# EasyEDA Pro project 32位四合一电调核心板.epro, schematic 100V_四路_控制板
Board Name: 100V_四路_控制板; Create Date: 2025-03-10; Page Name: P1; Project Name: 32位四合一电调核心板; Schematic Name: 100V_四路_控制板; Update Date: 2025-03-10; Company: urmouky; Drawed: urmouky; Page Size: A4; Reviewed: urmouky; Version: V1.0
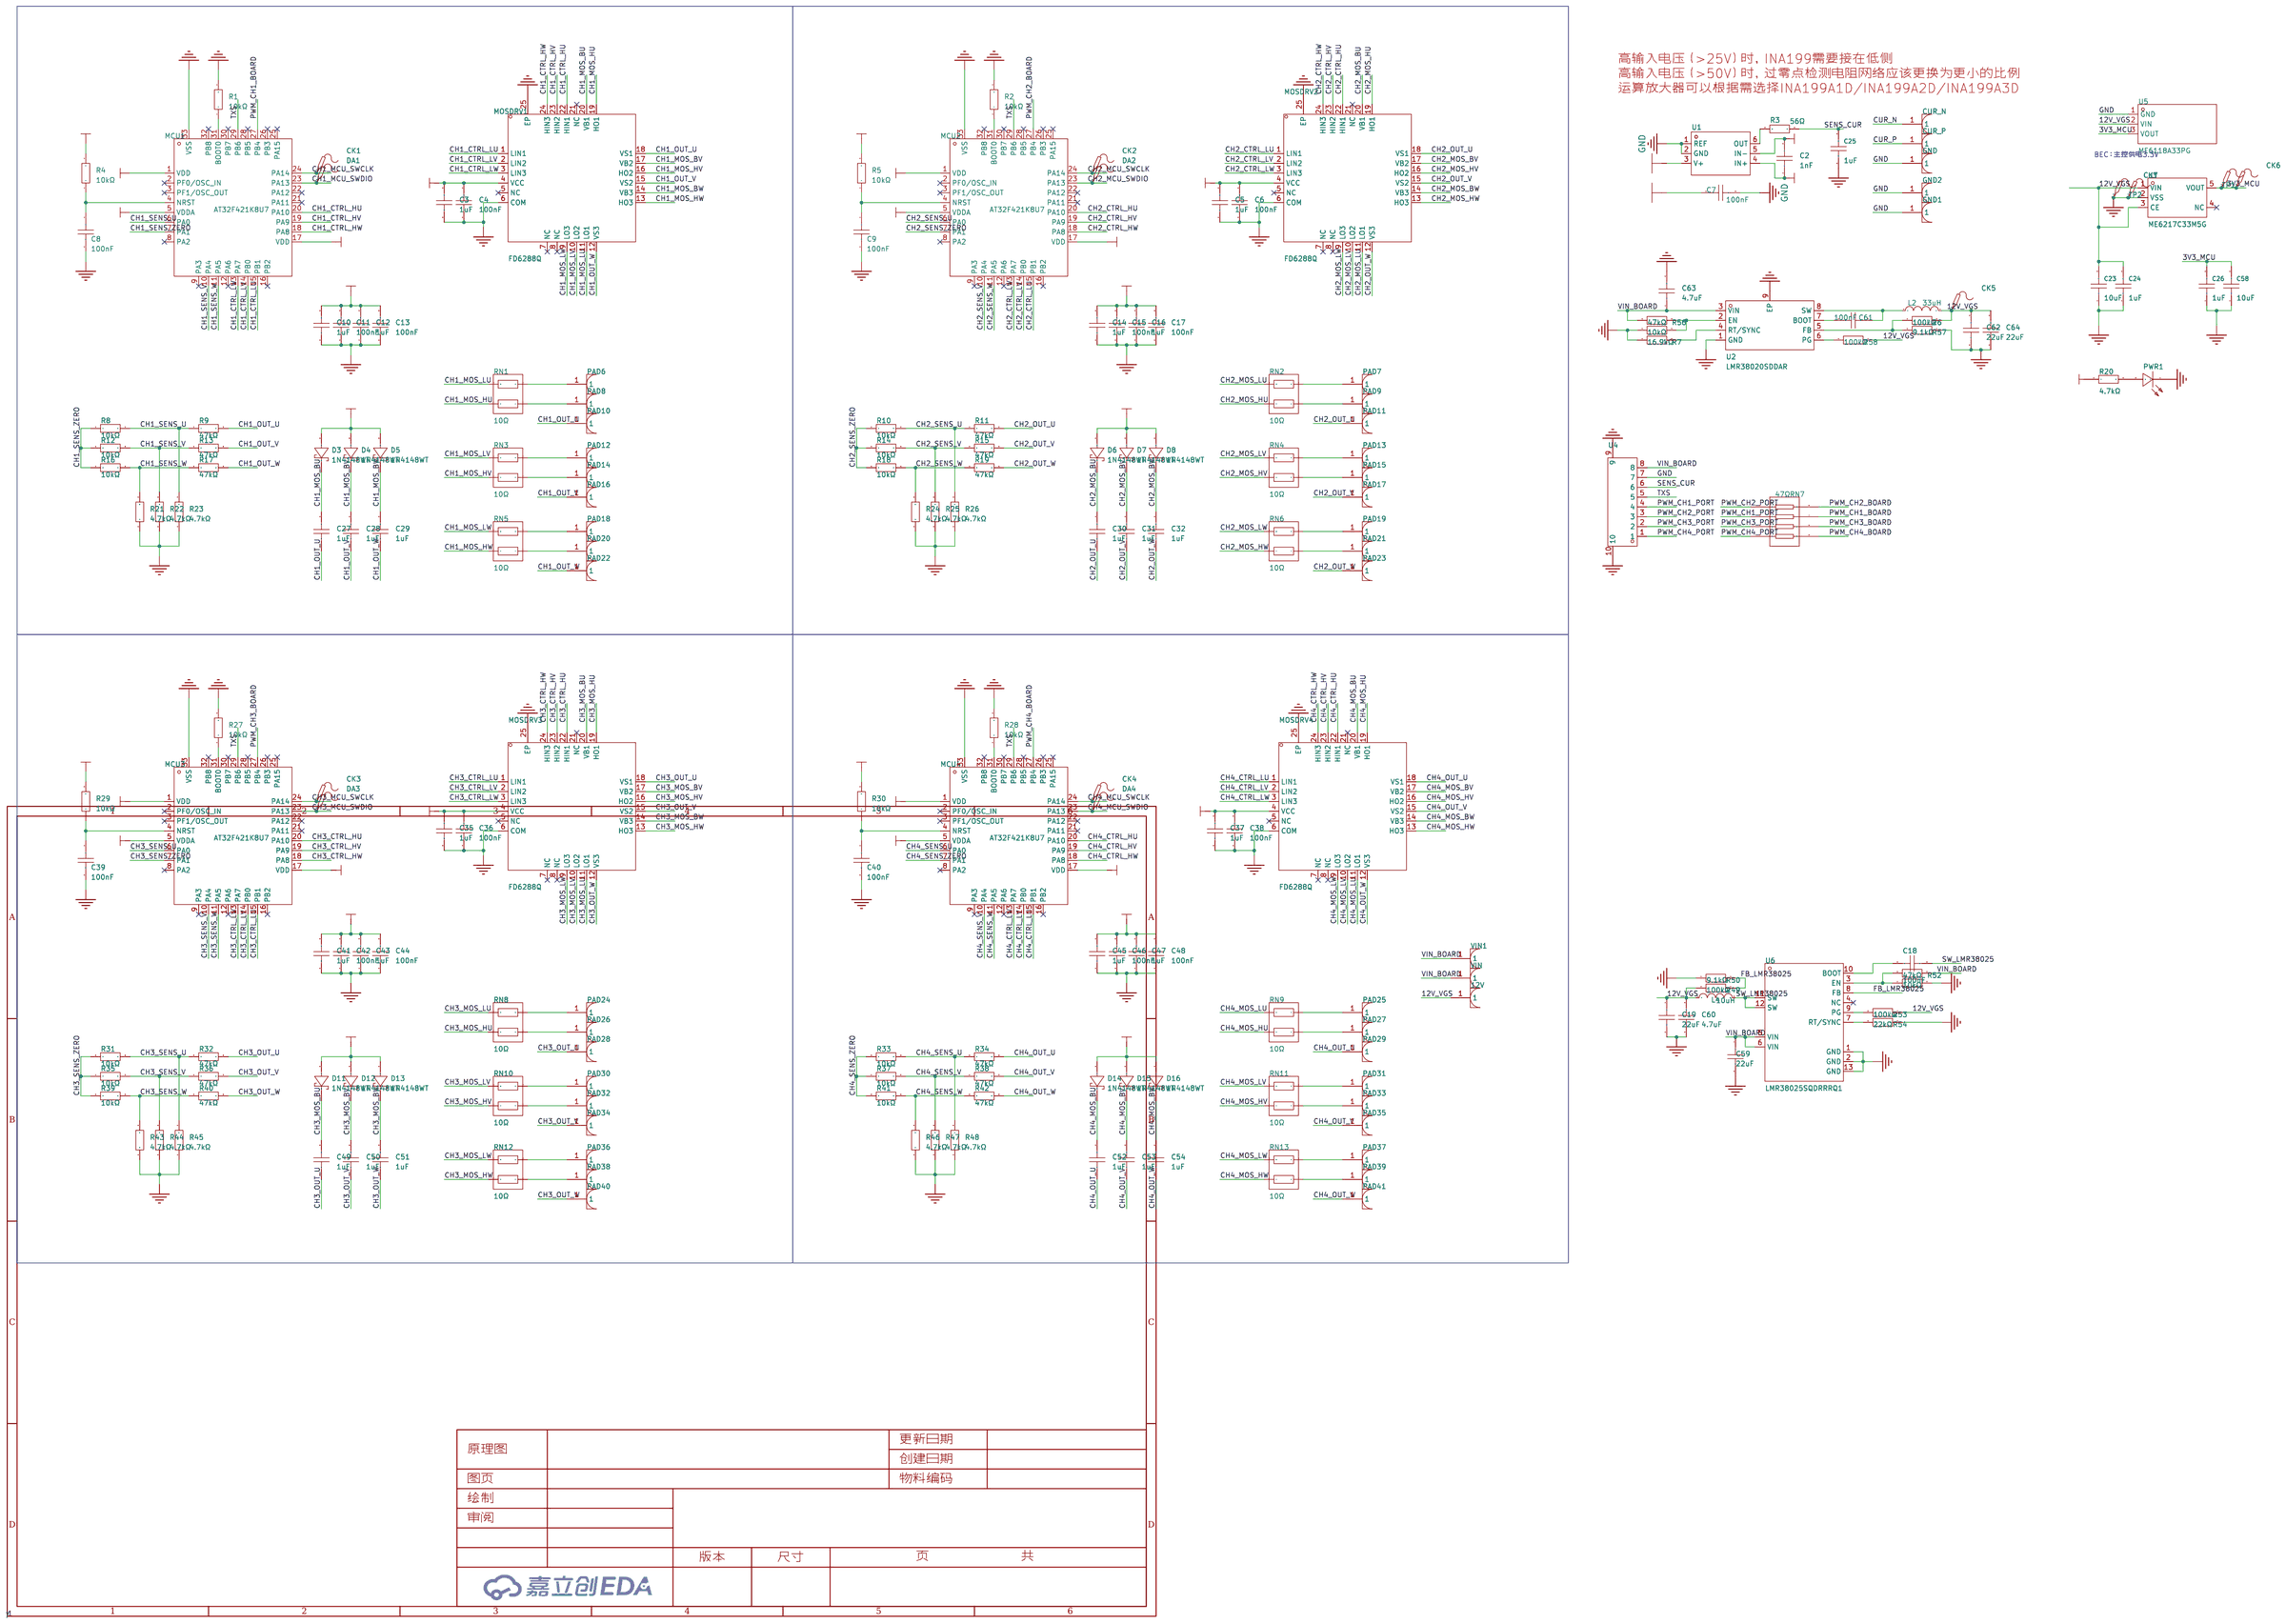
[diagram p0: schematic sheet]

## Parts
12V  -  [邮票孔1mm方]  (no BOM)
C2  1nF  [R0402]
C3  1uF  [R0402]  (no BOM)
C4  100nF  [R0402]
C5  1uF  [R0402]  (no BOM)
C6  100nF  [R0402]
C7  100nF  [R0402]
C8  100nF  [R0402]
C9  100nF  [R0402]
C10  1uF  [R0402]
C11  100nF  [R0402]
C12  1uF  [R0402]  (no BOM)
C13  100nF  [R0402]  (no BOM)
C14  1uF  [R0402]
C15  100nF  [R0402]
C16  1uF  [R0402]  (no BOM)
C17  100nF  [R0402]  (no BOM)
C18  100nF  [R0402]  (no BOM)
C19  22uF  [C1206]  (no BOM)
C23  10uF  [R0603]
C24  1uF  [R0402]
C25  1uF  [R0402]
C26  1uF  [R0402]
C27  1uF  [R0402]
C28  1uF  [R0402]
C29  1uF  [R0402]
C30  1uF  [R0402]
C31  1uF  [R0402]
C32  1uF  [R0402]
C35  1uF  [R0402]  (no BOM)
C36  100nF  [R0402]
C37  1uF  [R0402]  (no BOM)
C38  100nF  [R0402]
C39  100nF  [R0402]
C40  100nF  [R0402]
C41  1uF  [R0402]
C42  100nF  [R0402]
C43  1uF  [R0402]  (no BOM)
C44  100nF  [R0402]  (no BOM)
C45  1uF  [R0402]
C46  100nF  [R0402]
C47  1uF  [R0402]  (no BOM)
C48  100nF  [R0402]  (no BOM)
C49  1uF  [R0402]
C50  1uF  [R0402]
C51  1uF  [R0402]
C52  1uF  [R0402]
C53  1uF  [R0402]
C54  1uF  [R0402]
C58  10uF  [R0603]
C59  22uF  [C1206]  (no BOM)
C60  4.7uF  [C0805]  (no BOM)
C61  100nF  [R0402]
C62  22uF  [C1206]
C63  4.7uF  [C1206]
C64  22uF  [CAP-SMD_L3.5-W2.8-R-RD]
CK1  -  [Test-Point-0.5mm]  (no BOM)
CK2  -  [Test-Point-0.5mm]  (no BOM)
CK3  -  [Test-Point-0.5mm]  (no BOM)
CK4  -  [Test-Point-0.5mm]  (no BOM)
CK5  -  [Test-Point-0.5mm]  (no BOM)
CK6  -  [Test-Point-0.5mm]  (no BOM)
CK7  -  [Test-Point-0.5mm]  (no BOM)
CUR_N  -  [邮票孔1mm方]  (no BOM)
CUR_P  -  [邮票孔1mm方]  (no BOM)
D3  1N4148WT  [SOD-523_L1.2-W0.8-LS1.6-RD]
D4  1N4148WT  [SOD-523_L1.2-W0.8-LS1.6-RD]
D5  1N4148WT  [SOD-523_L1.2-W0.8-LS1.6-RD]
D6  1N4148WT  [SOD-523_L1.2-W0.8-LS1.6-RD]
D7  1N4148WT  [SOD-523_L1.2-W0.8-LS1.6-RD]
D8  1N4148WT  [SOD-523_L1.2-W0.8-LS1.6-RD]
D11  1N4148WT  [SOD-523_L1.2-W0.8-LS1.6-RD]
D12  1N4148WT  [SOD-523_L1.2-W0.8-LS1.6-RD]
D13  1N4148WT  [SOD-523_L1.2-W0.8-LS1.6-RD]
D14  1N4148WT  [SOD-523_L1.2-W0.8-LS1.6-RD]
D15  1N4148WT  [SOD-523_L1.2-W0.8-LS1.6-RD]
D16  1N4148WT  [SOD-523_L1.2-W0.8-LS1.6-RD]
DA1  -  [Test-Point-0.5mm]  (no BOM)
DA2  -  [Test-Point-0.5mm]  (no BOM)
DA3  -  [Test-Point-0.5mm]  (no BOM)
DA4  -  [Test-Point-0.5mm]  (no BOM)
GND  -  [邮票孔1mm方]  (no BOM)
GND1  -  [邮票孔1mm方]  (no BOM)
GND2  -  [邮票孔1mm方]  (no BOM)
L2  33uH  [IND-SMD_L5.4-W5.2]
L4  10uH  [IND-SMD_L5.4-W5.2]  (no BOM)
MCU1  AT32F421K8U7  [QFN-32_L5.0-W5.0-P0.50-BL-EP3.4]
MCU2  AT32F421K8U7  [QFN-32_L5.0-W5.0-P0.50-BL-EP3.4]
MCU3  AT32F421K8U7  [QFN-32_L5.0-W5.0-P0.50-BL-EP3.4]
MCU4  AT32F421K8U7  [QFN-32_L5.0-W5.0-P0.50-BL-EP3.4]
MOSDRV1  FD6288Q  [QFN-24_L4.0-W4.0-P0.50-BL-EP2.6]
MOSDRV2  FD6288Q  [QFN-24_L4.0-W4.0-P0.50-BL-EP2.6]
MOSDRV3  FD6288Q  [QFN-24_L4.0-W4.0-P0.50-BL-EP2.6]
MOSDRV4  FD6288Q  [QFN-24_L4.0-W4.0-P0.50-BL-EP2.6]
PAD6  -  [邮票孔1mm方]  (no BOM)
PAD7  -  [邮票孔1mm方]  (no BOM)
PAD8  -  [邮票孔1mm方]  (no BOM)
PAD9  -  [邮票孔1mm方]  (no BOM)
PAD10  -  [邮票孔1mm方]  (no BOM)
PAD11  -  [邮票孔1mm方]  (no BOM)
PAD12  -  [邮票孔1mm方]  (no BOM)
PAD13  -  [邮票孔1mm方]  (no BOM)
PAD14  -  [邮票孔1mm方]  (no BOM)
PAD15  -  [邮票孔1mm方]  (no BOM)
PAD16  -  [邮票孔1mm方]  (no BOM)
PAD17  -  [邮票孔1mm方]  (no BOM)
PAD18  -  [邮票孔1mm方]  (no BOM)
PAD19  -  [邮票孔1mm方]  (no BOM)
PAD20  -  [邮票孔1mm方]  (no BOM)
PAD21  -  [邮票孔1mm方]  (no BOM)
PAD22  -  [邮票孔1mm方]  (no BOM)
PAD23  -  [邮票孔1mm方]  (no BOM)
PAD24  -  [邮票孔1mm方]  (no BOM)
PAD25  -  [邮票孔1mm方]  (no BOM)
PAD26  -  [邮票孔1mm方]  (no BOM)
PAD27  -  [邮票孔1mm方]  (no BOM)
PAD28  -  [邮票孔1mm方]  (no BOM)
PAD29  -  [邮票孔1mm方]  (no BOM)
PAD30  -  [邮票孔1mm方]  (no BOM)
PAD31  -  [邮票孔1mm方]  (no BOM)
PAD32  -  [邮票孔1mm方]  (no BOM)
PAD33  -  [邮票孔1mm方]  (no BOM)
PAD34  -  [邮票孔1mm方]  (no BOM)
PAD35  -  [邮票孔1mm方]  (no BOM)
PAD36  -  [邮票孔1mm方]  (no BOM)
PAD37  -  [邮票孔1mm方]  (no BOM)
PAD38  -  [邮票孔1mm方]  (no BOM)
PAD39  -  [邮票孔1mm方]  (no BOM)
PAD40  -  [邮票孔1mm方]  (no BOM)
PAD41  -  [邮票孔1mm方]  (no BOM)
PWR1  NCD0603G1  [LED0603-RD_1]
R1  10kΩ  [R0402]
R2  10kΩ  [R0402]
R3  56Ω  [R0402]
R4  10kΩ  [R0402]
R5  10kΩ  [R0402]
R6  100kΩ  [R0402]
R7  16.9kΩ  [R0402]
R8  10kΩ  [R0402]
R9  47kΩ  [R0402]
R10  10kΩ  [R0402]
R11  47kΩ  [R0402]
R12  10kΩ  [R0402]
R13  47kΩ  [R0402]
R14  10kΩ  [R0402]
R15  47kΩ  [R0402]
R16  10kΩ  [R0402]
R17  47kΩ  [R0402]
R18  10kΩ  [R0402]
R19  47kΩ  [R0402]
R20  4.7kΩ  [R0402]
R21  4.7kΩ  [R0402]
R22  4.7kΩ  [R0402]
R23  4.7kΩ  [R0402]
R24  4.7kΩ  [R0402]
R25  4.7kΩ  [R0402]
R26  4.7kΩ  [R0402]
R27  10kΩ  [R0402]
R28  10kΩ  [R0402]
R29  10kΩ  [R0402]
R30  10kΩ  [R0402]
R31  10kΩ  [R0402]
R32  47kΩ  [R0402]
R33  10kΩ  [R0402]
R34  47kΩ  [R0402]
R35  10kΩ  [R0402]
R36  47kΩ  [R0402]
R37  10kΩ  [R0402]
R38  47kΩ  [R0402]
R39  10kΩ  [R0402]
R40  47kΩ  [R0402]
R41  10kΩ  [R0402]
R42  47kΩ  [R0402]
R43  4.7kΩ  [R0402]
R44  4.7kΩ  [R0402]
R45  4.7kΩ  [R0402]
R46  4.7kΩ  [R0402]
R47  4.7kΩ  [R0402]
R48  4.7kΩ  [R0402]
R49  100kΩ  [R0402]  (no BOM)
R50  9.1kΩ  [R0402]  (no BOM)
R51  10kΩ  [R0402]  (no BOM)
R52  47kΩ  [R0402]  (no BOM)
R53  100kΩ  [R0402]  (no BOM)
R54  22kΩ  [R0402]  (no BOM)
R55  10kΩ  [R0402]
R56  47kΩ  [R0402]
R57  9.1kΩ  [R0402]
R58  100kΩ  [R0402]
RN1  10Ω  [RES-ARRAY-SMD_0402-4P-L1.0-W1.0-BL]
RN2  10Ω  [RES-ARRAY-SMD_0402-4P-L1.0-W1.0-BL]
RN3  10Ω  [RES-ARRAY-SMD_0402-4P-L1.0-W1.0-BL]
RN4  10Ω  [RES-ARRAY-SMD_0402-4P-L1.0-W1.0-BL]
RN5  10Ω  [RES-ARRAY-SMD_0402-4P-L1.0-W1.0-BL]
RN6  10Ω  [RES-ARRAY-SMD_0402-4P-L1.0-W1.0-BL]
RN7  47Ω  [RES-ARRAY-SMD_0402-8P-L2.0-W1.0-BL]
RN8  10Ω  [RES-ARRAY-SMD_0402-4P-L1.0-W1.0-BL]
RN9  10Ω  [RES-ARRAY-SMD_0402-4P-L1.0-W1.0-BL]
RN10  10Ω  [RES-ARRAY-SMD_0402-4P-L1.0-W1.0-BL]
RN11  10Ω  [RES-ARRAY-SMD_0402-4P-L1.0-W1.0-BL]
RN12  10Ω  [RES-ARRAY-SMD_0402-4P-L1.0-W1.0-BL]
RN13  10Ω  [RES-ARRAY-SMD_0402-4P-L1.0-W1.0-BL]
TP1  -  [Test-Point-0.5mm]  (no BOM)
TP2  -  [Test-Point-0.5mm]  (no BOM)
U1  INA199A1DCKR  [SC-70-6_L2.2-W1.3-P0.65-LS2.1-BR]
U2  LMR38020SDDAR  [ESOP-8_L4.9-W3.9-P1.27-LS6.0-BL-EP-1]
U3  ME6217C33M5G  [SOT-23-5_L3.0-W1.7-P0.95-LS2.8-BR]  (no BOM)
U4  HDGC1002WR-S-8P  [CONN-SMD_8P-P1.00_HDGC_HDGC1002WR-S-8P]
U5  ME6118A33PG  [SOT-89-3_L4.5-W2.5-P1.50-LS4.2-BR]
U6  LMR38025SQDRRRQ1  [SON-12_L3.0-W3.0-P0.50-BL-EP]  (no BOM)
VIN  -  [邮票孔1mm方]  (no BOM)
VIN1  -  [邮票孔1mm方]  (no BOM)

## Library data of the parts
12V CUR_N CUR_P GND GND1 GND2 PAD6-PAD41 VIN VIN1 = 邮票孔1mm方: 1mm方形邮票孔
C2 = CC0402KRX7R9BB102: 容值:1nF;精度:±10%;额定电压:50V;材质(温度系数):X7R;; LCSC Part Name: 1nF ±10% 50V; Supplier Part: C106205; Manufacturer: YAGEO(国巨); Supplier Footprint: 0402; JLCPCB Part Class: Extended Part; Datasheet: https://atta.szlcsc.com/upload/public/pdf/source/20181008/C309510_22F155564471FAF6A489F7D68F34234E.pdf; Supplier: LCSC; Tolerance: ±10%; Voltage Rated: 50V; Temperature Coefficient: X7R
C3 C5 C10 C12 C14 C16 C24-C32 C35 C37 C41 C43 C45 C47 C49-C54 = CGA0402X5R105K500GT: 容值:1uF;精度:±10%;额定电压:50V;材质(温度系数):X5R;; LCSC Part Name: 1uF ±10% 50V; Supplier Part: C6119811; Manufacturer: HRE(芯声); Supplier Footprint: 0402; JLCPCB Part Class: Extended Part; Supplier: LCSC; Tolerance: ±10%; Voltage Rated: 50V; Temperature Coefficient: X5R
C4 C6 C8 C9 C11 C13 C15 C17 C18 C36 C38-C40 C42 C44 C46 C48 C61 = GRM155R71H104KE14D: 容值:100nF;精度:±10%;额定电压:50V;材质(温度系数):X7R;; LCSC Part Name: 100nF ±10% 50V; Supplier Part: C77020; Manufacturer: muRata(村田); Supplier Footprint: 0402; JLCPCB Part Class: Extended Part; Datasheet: https://atta.szlcsc.com/upload/public/pdf/source/20180326/C77020_39BD49C951FF1AF0DB1F1FAC5AC1E401.pdf; Supplier: LCSC; Tolerance: ±10%; Voltage Rated: 50V; Temperature Coefficient: X7R
C7 = CAP_0402: 容值:100nF;精度:±10%;额定电压:16V;温度系数:X7R;; Supplier Part: C1525; Supplier Footprint: 0402
C19 C59 C62 = CL31A226KAHNNNE: 容值:22uF;精度:±10%;额定电压:25V;材质(温度系数):X5R;; LCSC Part Name: 22uF ±10% 25V; Supplier Part: C12891; Manufacturer: SAMSUNG(三星); Supplier Footprint: 1206; JLCPCB Part Class: Basic Part; Datasheet: https://atta.szlcsc.com/upload/public/pdf/source/20160218/1457707763339.pdf; Supplier: LCSC; Tolerance: ±10%; Voltage Rated: 25V; Temperature Coefficient: X5R
C23 C58 = GRM188R61E106KA73D: 容值:10uF;精度:±10%;额定电压:25V;材质(温度系数):X5R;; LCSC Part Name: 10uF ±10% 25V; Supplier Part: C344022; Manufacturer: muRata(村田); Supplier Footprint: 0603; JLCPCB Part Class: Extended Part; Datasheet: https://atta.szlcsc.com/upload/public/pdf/source/20181211/C344022_BB98D43E7DA95E5A749FBFE073C8A3E0.pdf; Supplier: LCSC; Tolerance: ±10%; Voltage Rated: 25V; Temperature Coefficient: X5R
C60 = C2012X5R2A475K125AC: 容值:4.7uF;精度:±10%;额定电压:100V;材质(温度系数):X5R;; LCSC Part Name: 4.7uF ±10% 100V; Supplier Part: C3848621; Manufacturer: TDK; Supplier Footprint: 0805; JLCPCB Part Class: 扩展库; Datasheet: https://atta.szlcsc.com/upload/public/pdf/source/231023/files-179e77ec57705f1f6a0fa868e4e425d4.pdf; Supplier: LCSC; Tolerance: ±10%; Voltage Rated: 100V; Temperature Coefficient: X5R
C63 = GRM31CC72A475KE11L: 容值:4.7uF;精度:±10%;额定电压:100V;材质(温度系数):X7S;; LCSC Part Name: 4.7uF ±10% 100V; Supplier Part: C237304; Manufacturer: muRata(村田); Supplier Footprint: 1206; JLCPCB Part Class: Extended Part; Datasheet: https://atta.szlcsc.com/upload/public/pdf/source/20200508/C237304_4DE028CC8A94E401326C46A1633456FC.pdf; Supplier: LCSC; Tolerance: ±10%; Voltage Rated: 100V; Temperature Coefficient: X7S
C64 = TAJB226K020RNJ: 容值:22uF;精度:±10%;额定电压:20V;等效串联电阻:1.8Ω@100kHz;; LCSC Part Name: 22uF ±10% 20V; Supplier Part: C7199; Manufacturer: Kyocera AVX; Supplier Footprint: CASE-B-3528; JLCPCB Part Class: Extended Part; Datasheet: https://atta.szlcsc.com/upload/public/pdf/source/20160107/1457707750344.pdf; Supplier: LCSC; Tolerance: ±10%; Rated Voltage: 20V; Equivalent Series Resistance(ESR): 1.8Ω@100kHz; Operating Temperature: -55℃~+125℃
CK1-CK7 DA1-DA4 TP1 TP2 = Test-Point: Test Point 测试点
D3-D8 D11-D16 = 1N4148WT_C727112: 二极管配置:独立式;正向压降(Vf):1.25V@150mA;直流反向耐压(Vr):75V;平均整流电流(Io):125mA;反向恢复时间(trr):4ns;; LCSC Part Name: 电压:75V 电流:125mA; Supplier Part: C727112; Manufacturer: TWGMC(台湾迪嘉); Supplier Footprint: SOD-523; JLCPCB Part Class: 扩展库; Datasheet: https://atta.szlcsc.com/upload/public/pdf/source/20200828/C727112_FCA71CBB186A515518FBD85DA79D41CF.pdf; Supplier: LCSC; Diode Configuration: 独立式; Forward Voltage (Vf@If): 1.25V@150mA; Reverse Voltage (Vr): 75V; Average Rectified Current (Io): 125mA; Reverse Leakage Current: 1uA@75V; Reverse Recovery Time (trr): 4ns; Operating Temperature: -65℃~+150℃@(Tj)
L2 L4 = ZEMS0530-330M: 电感值:33uH;精度:±20%;额定电流:1.2A;饱和电流(Isat):2A;类型:一体成型电感;; Supplier Part: C41413117; Manufacturer: ZE(增益); Supplier Footprint: SMD,5.4x5.2mm; Datasheet: https://atta.szlcsc.com/upload/public/pdf/source/20240923/DDA01E9BD2756F7277569EBE56A30EF4.pdf; Supplier: LCSC; Tolerance: ±20%; Rated Current: 1.2A; Saturation Current (Isat): 2A; DC Resistance (DCR): 395mΩ; Type: 一体成型电感
MCU1-MCU4 = AT32F421K8U7: Supplier Part: C2965611; Manufacturer: ARTERY(雅特力); Supplier Footprint: QFN-32; JLCPCB Part Class: 扩展库; Supplier: LCSC
MOSDRV1-MOSDRV4 = FD6288Q: Supplier Part: C328453; Manufacturer: Fortior Tech(峰岹); Supplier Footprint: QFN-24-EP(4x4); JLCPCB Part Class: 扩展库; Datasheet: https://atta.szlcsc.com/upload/public/pdf/source/20181108/C328453_785547738DB9FC0123219FC22539EFAD.pdf; Supplier: LCSC
PWR1 = NCD0603G1: 发光颜色:翠绿色;正向电压(VF):2.6V~3.6V;功率:72mW;正向电流:10mA;主波长:515nm~530nm;透镜颜色:无色透明透镜;发光强度:330mcd~900mcd;发光角度:130°;工作温度:-30℃~+85℃;; Supplier Part: C84267; Manufacturer: 国星光电; Supplier Footprint: 0603; JLCPCB Part Class: Extended Part; Datasheet: https://atta.szlcsc.com/upload/public/pdf/source/20200820/C84267_04BA7703640BAC111D09F5EFB971FBF3.pdf; Supplier: LCSC; Emitted Color: 翠绿色; Forward Voltage (VF): 2.6V~3.6V; Power Dissipation: 72mW; Forward Current: 10mA; Dominant Wavelength: 515nm~530nm; Lens Color: 无色透明透镜; Luminous Intensity: 330mcd~900mcd; Viewing Angle: 130°; Operating Temperature: -30℃~+85℃
R1 R2 R4 R5 R8 R10 R12 R14 R16 R18 R27-R31 R33 R35 R37 R39 R41 R51 R55 = RC0402FR-0710KL: 电阻类型:厚膜电阻;阻值:10kΩ;精度:±1%;功率:62.5mW;最大工作电压:50V;温度系数:±100ppm/℃;; LCSC Part Name: 厚膜电阻 10kΩ ±1% 62.5mW; Supplier Part: C60490; Manufacturer: YAGEO(国巨); Supplier Footprint: 0402; JLCPCB Part Class: Extended Part; Datasheet: https://atta.szlcsc.com/upload/public/pdf/source/20170925/C131467_1506321478108990263.pdf; Supplier: LCSC; Type: 厚膜电阻; Tolerance: ±1%; Power(Watts): 62.5mW; Overload Voltage (Max): 50V; Temperature Coefficient: ±100ppm/℃; Operating Temperature Range: -55℃~+155℃
R3 = 0402WGF560JTCE: 电阻类型:厚膜电阻;阻值:56Ω;精度:±1%;功率:62.5mW;最大工作电压:50V;温度系数:±100ppm/℃;; LCSC Part Name: 56Ω ±1% 62.5mW 厚膜电阻; Supplier Part: C25127; Manufacturer: UNI-ROYAL(厚声); Supplier Footprint: 0402; JLCPCB Part Class: Extended Part; Datasheet: https://atta.szlcsc.com/upload/public/pdf/source/20200306/C422600_1E6D84923E4A46A82E41ADD87F860B5C.pdf; Supplier: LCSC; Type: 厚膜电阻; Tolerance: ±1%; Power(Watts): 62.5mW; Overload Voltage (Max): 50V; Temperature Coefficient: ±100ppm/℃; Operating Temperature Range: -55℃~+155℃
R6 R49 R53 R54 R58 = 0402WGF1003TCE: 电阻类型:厚膜电阻;阻值:100kΩ;精度:±1%;功率:62.5mW;最大工作电压:50V;温度系数:±100ppm/℃;; LCSC Part Name: 100kΩ ±1% 62.5mW 厚膜电阻; Supplier Part: C25741; Manufacturer: UNI-ROYAL(厚声); Supplier Footprint: 0402; JLCPCB Part Class: 基础库; Datasheet: https://atta.szlcsc.com/upload/public/pdf/source/20200306/C422600_1E6D84923E4A46A82E41ADD87F860B5C.pdf; Supplier: LCSC; Type: 厚膜电阻; Tolerance: ±1%; Power(Watts): 62.5mW; Overload Voltage (Max): 50V; Temperature Coefficient: ±100ppm/℃; Operating Temperature Range: -55℃~+155℃
R7 = 0402WGF1692TCE: 电阻类型:厚膜电阻;阻值:16.9kΩ;精度:±1%;功率:62.5mW;最大工作电压:50V;温度系数:±100ppm/℃;; LCSC Part Name: 16.9kΩ ±1% 62.5mW 厚膜电阻; Supplier Part: C25858; Manufacturer: UNI-ROYAL(厚声); Supplier Footprint: 0402; JLCPCB Part Class: 扩展库; Datasheet: https://atta.szlcsc.com/upload/public/pdf/source/20200306/C422600_1E6D84923E4A46A82E41ADD87F860B5C.pdf; Supplier: LCSC; Type: 厚膜电阻; Tolerance: ±1%; Power(Watts): 62.5mW; Overload Voltage (Max): 50V; Temperature Coefficient: ±100ppm/℃; Operating Temperature Range: -55℃~+155℃
R9 R11 R13 R15 R17 R19 R32 R34 R36 R38 R40 R42 R52 R56 = 0402WGF4702TCE: 电阻类型:厚膜电阻;阻值:47kΩ;精度:±1%;功率:62.5mW;最大工作电压:50V;温度系数:±100ppm/℃;; LCSC Part Name: 47kΩ ±1% 62.5mW 厚膜电阻; Supplier Part: C25792; Manufacturer: UNI-ROYAL(厚声); Supplier Footprint: 0402; JLCPCB Part Class: Basic Part; Datasheet: https://atta.szlcsc.com/upload/public/pdf/source/20200306/C422600_1E6D84923E4A46A82E41ADD87F860B5C.pdf; Supplier: LCSC; Type: 厚膜电阻; Tolerance: ±1%; Power(Watts): 62.5mW; Overload Voltage (Max): 50V; Temperature Coefficient: ±100ppm/℃; Operating Temperature Range: -55℃~+155℃
R20-R26 R43-R48 = 0402WGF4701TCE: 电阻类型:厚膜电阻;阻值:4.7kΩ;精度:±1%;功率:62.5mW;最大工作电压:50V;温度系数:±100ppm/℃;; LCSC Part Name: 4.7kΩ ±1% 62.5mW 厚膜电阻; Supplier Part: C25900; Manufacturer: UNI-ROYAL(厚声); Supplier Footprint: 0402; JLCPCB Part Class: Basic Part; Datasheet: https://atta.szlcsc.com/upload/public/pdf/source/20200306/C422600_1E6D84923E4A46A82E41ADD87F860B5C.pdf; Supplier: LCSC; Type: 厚膜电阻; Tolerance: ±1%; Power(Watts): 62.5mW; Overload Voltage (Max): 50V; Temperature Coefficient: ±100ppm/℃; Operating Temperature Range: -55℃~+155℃
R50 R57 = 0402WGF9101TCE: 电阻类型:厚膜电阻;阻值:9.1kΩ;精度:±1%;功率:62.5mW;最大工作电压:50V;温度系数:±100ppm/℃;; LCSC Part Name: 9.1kΩ ±1% 62.5mW 厚膜电阻; Supplier Part: C25926; Manufacturer: UNI-ROYAL(厚声); Supplier Footprint: 0402; JLCPCB Part Class: 扩展库; Datasheet: https://atta.szlcsc.com/upload/public/pdf/source/20200306/C422600_1E6D84923E4A46A82E41ADD87F860B5C.pdf; Supplier: LCSC; Type: 厚膜电阻; Tolerance: ±1%; Power(Watts): 62.5mW; Overload Voltage (Max): 50V; Temperature Coefficient: ±100ppm/℃; Operating Temperature Range: -55℃~+155℃
RN1-RN6 RN8-RN13 = 2D02WGF100JTCE: 电阻器数:2;阻值:10Ω;精度:±1%;单个元件功率:62.5mW;温度系数:±200ppm/℃;; LCSC Part Name: 10Ω ±1%; Supplier Part: C270395; Manufacturer: UNI-ROYAL(厚声); Supplier Footprint: 0402x2; JLCPCB Part Class: 扩展库; Datasheet: https://atta.szlcsc.com/upload/public/pdf/source/20191224/C474318_2527498AE30E813171187CCD28401A71.pdf; Supplier: LCSC; Number of Resistors: 2; Tolerance: ±1%; Power(Watts): 62.5mW; Temperature Coefficient: ±200ppm/℃; Number of Pins: 4
RN7 = AF124-JR-0747RL: 电阻器数:4;阻值:47Ω;精度:±5%;单个元件功率:62.5mW;温度系数:±200ppm/℃;; LCSC Part Name: 47Ω ±5% 0402x4; Supplier Part: C723467; Manufacturer: YAGEO(国巨); Supplier Footprint: 0402x4; JLCPCB Part Class: Extended Part; Datasheet: https://atta.szlcsc.com/upload/public/pdf/source/20200817/C723467_726CADB538F6405BDC12AAE9A767035C.pdf; Supplier: LCSC; Number of Resistors: 4; Tolerance: ±5%; Power(Watts): 62.5mW; Temperature Coefficient: ±200ppm/℃; Number of Pins: 8
U1 = INA199A1DCKR: INA199 26V、双向、零漂移、低侧/高侧、电压输出分流监控器; Supplier Part: C59135; Manufacturer: TI(德州仪器); Supplier Footprint: SC-70-6(SOT-363); JLCPCB Part Class: Extended Part; Datasheet: https://atta.szlcsc.com/upload/public/pdf/source/20150921/1457707392422.pdf; Supplier: LCSC
U2 = LMR38020SDDAR: 功能类型:降压型;输出类型:可调;输入电压:4.2V~80V;输出电压:1V~75V;输出电流:2A;; Supplier Part: C3192337; Manufacturer: TI(德州仪器); Supplier Footprint: SO-8-PowerPad; JLCPCB Part Class: 扩展库; Datasheet: https://www.ti.com/cn/lit/gpn/lmr38020; Supplier: LCSC; Function: 降压型; Output Type: 可调; Input Voltage: 4.2V~80V; Output Voltage: 1V~75V; Output Current: 2A; Switching Frequency: 2.2MHz; Operating Temperature: -40℃~+125℃; Synchronous Rectification: 是; Number of Outputs: 1; Topology: 降压式; Switch tube (built-in/external): 内置
U3 = ME6217C33M5G: 输出类型:固定;输出极性:正;最大输入电压:7V;输出电压:3.3V;输出电流:800mA;电源纹波抑制比(PSRR):65dB@(1kHz);; Supplier Part: C427602; Manufacturer: MICRONE(南京微盟); Supplier Footprint: SOT-23-5; JLCPCB Part Class: 扩展库; Datasheet: https://atta.szlcsc.com/upload/public/pdf/source/20190910/C427602_D4B9162A2E9D9EF57C60010DFDECEF37.pdf; Supplier: LCSC; Output Type: 固定; Output Polarity: 正; Number of Outputs: 1; Maximum Input Voltage: 7V; Output Voltage: 3.3V; Dropout Voltage: 180mV@(300mA); Output Current: 800mA; Power Supply Rejection Ratio (PSRR): 65dB@(1kHz)
U4 = HDGC1002WR-S-8P: 参考系列:SH;间距:1mm;排数:1;每排PIN数:8;公母:公型插针;安装方式:卧贴;额定电流:1A;工作温度范围:-40℃~+85℃;; LCSC Part Name: SH 1mm 卧贴; Supplier Part: C3041142; Manufacturer: HDGC(华德共创); Supplier Footprint: SMD,P=1mm; JLCPCB Part Class: 扩展库; Datasheet: https://atta.szlcsc.com/upload/public/pdf/source/20220621/C2AA6A1A2A279F73FC0521BA202CB6E2.pdf; Supplier: LCSC; Reference Series: SH; Pitch: 1mm; Number of Rows: 1; Number of PINs Per Row: 8; Gender: 公型插针; Mounting Style: 卧贴; Current Rating (Max): 1A; Operating Temperature Range: -40℃~+85℃
U5 = ME6118A33PG: 输出类型:-;; Supplier Part: C236721; Manufacturer: MICRONE(南京微盟); Supplier Footprint: SOT-89-3; JLCPCB Part Class: 扩展库; Datasheet: https://atta.szlcsc.com/upload/public/pdf/source/20180709/C236722_8C795604A62DB63E4DCCB1C55FB5CFAC.pdf; Supplier: LCSC
U6 = LMR38025SQDRRRQ1: 功能类型:降压型;输出类型:-;工作电压:4.2V~80V;输出电压:-;输出电流:2.5A;; LCSC Part Name: 4.2V至80V输入、2.5A输出的汽车级同步降压转换器; Supplier Part: C22427956; Manufacturer: TI(德州仪器); Supplier Footprint: WSON-12-EP(3x3); JLCPCB Part Class: 扩展库; Supplier: LCSC; Function: 降压型; Input Voltage: 4.2V~80V; Output Current: 2.5A; Switching Frequency: 525kHz; Operating Temperature: -40℃~+150℃@(TJ); Synchronous Rectification: 是; Number of Outputs: 1; Switch tube (built-in/external): 内置

## Nets
3V3_MCU: C7.1 C10.2 C11.2 C12.2 C13.2 C14.2 C15.2 C16.2 C17.2 C26.2 C41.2 C42.2 C43.2 C44.2 C45.2 C46.2 C47.2 C48.2 C58.2 CK6.1 MCU1.1(VDD) MCU1.5(VDDA) MCU1.17(VDD) MCU2.1(VDD) MCU2.5(VDDA) MCU2.17(VDD) MCU3.1(VDD) MCU3.5(VDDA) MCU3.17(VDD) MCU4.1(VDD) MCU4.5(VDDA) MCU4.17(VDD) R4.2 R5.2 R20.1 R29.2 R30.2 TP1.1 U1.3(V+) U3.5(VOUT) U5.3(VOUT)
12V_VGS: 12V.1 C3.2 C4.2 C5.2 C6.2 C19.1 C23.2 C24.2 C35.2 C36.2 C37.2 C38.2 C60.2 C62.1 C64.1 CK5.1 D3.2(A) D4.2(A) D5.2(A) D6.2(A) D7.2(A) D8.2(A) D11.2(A) D12.2(A) D13.2(A) D14.2(A) D15.2(A) D16.2(A) L2.2 L4.1 MOSDRV1.4(VCC) MOSDRV2.4(VCC) MOSDRV3.4(VCC) MOSDRV4.4(VCC) R6.2 R49.2 R53.1 R58.1 U3.1(VIN) U3.3(CE) U5.2(VIN)
GND: C3.1 C4.1 C5.1 C6.1 C7.2 C8.2 C9.2 C10.1 C11.1 C12.1 C13.1 C14.1 C15.1 C16.1 C17.1 C19.2 C23.1 C24.1 C25.1 C26.1 C35.1 C36.1 C37.1 C38.1 C39.2 C40.2 C41.1 C42.1 C43.1 C44.1 C45.1 C46.1 C47.1 C48.1 C58.1 C59.2 C60.1 C62.2 C63.2 C64.2 CK7.1 GND.1 GND1.1 GND2.1 MCU1.33(VSS) MCU2.33(VSS) MCU3.33(VSS) MCU4.33(VSS) MOSDRV1.6(COM) MOSDRV1.25(EP) MOSDRV2.6(COM) MOSDRV2.25(EP) MOSDRV3.6(COM) MOSDRV3.25(EP) MOSDRV4.6(COM) MOSDRV4.25(EP) PWR1.1(K) R1.2 R2.2 R7.1 R21.1 R22.1 R23.1 R24.1 R25.1 R26.1 R27.2 R28.2 R43.1 R44.1 R45.1 R46.1 R47.1 R48.1 R50.1 R51.2 R54.1 R55.1 R57.1 TP2.1 U1.1(REF) U1.2(GND) U2.1(GND) U2.9(EP) U3.2(VSS) U4.7 U4.9 U4.10 U5.1(GND) U6.1(GND) U6.2(GND) U6.13(GND)
VIN_BOARD: C59.1 C63.1 R52.2 R56.1 U2.3(VIN) U4.8 U6.5(VIN) U6.6(VIN) VIN.1 VIN1.1
CH1_CTRL_HU: MCU1.20(PA10) MOSDRV1.22(HIN1)
CH1_CTRL_HV: MCU1.19(PA9) MOSDRV1.23(HIN2)
CH1_CTRL_HW: MCU1.18(PA8) MOSDRV1.24(HIN3)
CH1_CTRL_LU: MCU1.15(PB1) MOSDRV1.1(LIN1)
CH1_CTRL_LV: MCU1.14(PB0) MOSDRV1.2(LIN2)
CH1_CTRL_LW: MCU1.13(PA7) MOSDRV1.3(LIN3)
CH1_MCU_SWCLK: CK1.1 MCU1.24(PA14)
CH1_MCU_SWDIO: DA1.1 MCU1.23(PA13)
CH1_MOS_BU: C27.2 D3.1(C) MOSDRV1.20(VB1)
CH1_MOS_BV: C28.2 D4.1(C) MOSDRV1.17(VB2)
CH1_MOS_BW: C29.2 D5.1(C) MOSDRV1.14(VB3)
CH1_MOS_HU: MOSDRV1.19(HO1) RN1.4
CH1_MOS_HV: MOSDRV1.16(HO2) RN3.4
CH1_MOS_HW: MOSDRV1.13(HO3) RN5.4
CH1_MOS_LU: MOSDRV1.11(LO1) RN1.3
CH1_MOS_LV: MOSDRV1.10(LO2) RN3.3
CH1_MOS_LW: MOSDRV1.9(LO3) RN5.3
CH1_OUT_U: C27.1 MOSDRV1.18(VS1) PAD10.1 R9.2
CH1_OUT_V: C28.1 MOSDRV1.15(VS2) PAD16.1 R13.2
CH1_OUT_W: C29.1 MOSDRV1.12(VS3) PAD22.1 R17.2
CH1_SENS_U: MCU1.6(PA0) R8.2 R9.1 R23.2
CH1_SENS_V: MCU1.10(PA4) R12.2 R13.1 R22.2
CH1_SENS_W: MCU1.11(PA5) R16.2 R17.1 R21.2
CH1_SENS_ZERO: MCU1.7(PA1) R8.1 R12.1 R16.1
CH2_CTRL_HU: MCU2.20(PA10) MOSDRV2.22(HIN1)
CH2_CTRL_HV: MCU2.19(PA9) MOSDRV2.23(HIN2)
CH2_CTRL_HW: MCU2.18(PA8) MOSDRV2.24(HIN3)
CH2_CTRL_LU: MCU2.15(PB1) MOSDRV2.1(LIN1)
CH2_CTRL_LV: MCU2.14(PB0) MOSDRV2.2(LIN2)
CH2_CTRL_LW: MCU2.13(PA7) MOSDRV2.3(LIN3)
CH2_MCU_SWCLK: CK2.1 MCU2.24(PA14)
CH2_MCU_SWDIO: DA2.1 MCU2.23(PA13)
CH2_MOS_BU: C30.2 D6.1(C) MOSDRV2.20(VB1)
CH2_MOS_BV: C31.2 D7.1(C) MOSDRV2.17(VB2)
CH2_MOS_BW: C32.2 D8.1(C) MOSDRV2.14(VB3)
CH2_MOS_HU: MOSDRV2.19(HO1) RN2.4
CH2_MOS_HV: MOSDRV2.16(HO2) RN4.4
CH2_MOS_HW: MOSDRV2.13(HO3) RN6.4
CH2_MOS_LU: MOSDRV2.11(LO1) RN2.3
CH2_MOS_LV: MOSDRV2.10(LO2) RN4.3
CH2_MOS_LW: MOSDRV2.9(LO3) RN6.3
CH2_OUT_U: C30.1 MOSDRV2.18(VS1) PAD11.1 R11.2
CH2_OUT_V: C31.1 MOSDRV2.15(VS2) PAD17.1 R15.2
CH2_OUT_W: C32.1 MOSDRV2.12(VS3) PAD23.1 R19.2
CH2_SENS_U: MCU2.6(PA0) R10.2 R11.1 R26.2
CH2_SENS_V: MCU2.10(PA4) R14.2 R15.1 R25.2
CH2_SENS_W: MCU2.11(PA5) R18.2 R19.1 R24.2
CH2_SENS_ZERO: MCU2.7(PA1) R10.1 R14.1 R18.1
CH3_CTRL_HU: MCU3.20(PA10) MOSDRV3.22(HIN1)
CH3_CTRL_HV: MCU3.19(PA9) MOSDRV3.23(HIN2)
CH3_CTRL_HW: MCU3.18(PA8) MOSDRV3.24(HIN3)
CH3_CTRL_LU: MCU3.15(PB1) MOSDRV3.1(LIN1)
CH3_CTRL_LV: MCU3.14(PB0) MOSDRV3.2(LIN2)
CH3_CTRL_LW: MCU3.13(PA7) MOSDRV3.3(LIN3)
CH3_MCU_SWCLK: CK3.1 MCU3.24(PA14)
CH3_MCU_SWDIO: DA3.1 MCU3.23(PA13)
CH3_MOS_BU: C49.2 D11.1(C) MOSDRV3.20(VB1)
CH3_MOS_BV: C50.2 D12.1(C) MOSDRV3.17(VB2)
CH3_MOS_BW: C51.2 D13.1(C) MOSDRV3.14(VB3)
CH3_MOS_HU: MOSDRV3.19(HO1) RN8.4
CH3_MOS_HV: MOSDRV3.16(HO2) RN10.4
CH3_MOS_HW: MOSDRV3.13(HO3) RN12.4
CH3_MOS_LU: MOSDRV3.11(LO1) RN8.3
CH3_MOS_LV: MOSDRV3.10(LO2) RN10.3
CH3_MOS_LW: MOSDRV3.9(LO3) RN12.3
CH3_OUT_U: C49.1 MOSDRV3.18(VS1) PAD28.1 R32.2
CH3_OUT_V: C50.1 MOSDRV3.15(VS2) PAD34.1 R36.2
CH3_OUT_W: C51.1 MOSDRV3.12(VS3) PAD40.1 R40.2
CH3_SENS_U: MCU3.6(PA0) R31.2 R32.1 R45.2
CH3_SENS_V: MCU3.10(PA4) R35.2 R36.1 R44.2
CH3_SENS_W: MCU3.11(PA5) R39.2 R40.1 R43.2
CH3_SENS_ZERO: MCU3.7(PA1) R31.1 R35.1 R39.1
CH4_CTRL_HU: MCU4.20(PA10) MOSDRV4.22(HIN1)
CH4_CTRL_HV: MCU4.19(PA9) MOSDRV4.23(HIN2)
CH4_CTRL_HW: MCU4.18(PA8) MOSDRV4.24(HIN3)
CH4_CTRL_LU: MCU4.15(PB1) MOSDRV4.1(LIN1)
CH4_CTRL_LV: MCU4.14(PB0) MOSDRV4.2(LIN2)
CH4_CTRL_LW: MCU4.13(PA7) MOSDRV4.3(LIN3)
CH4_MCU_SWCLK: CK4.1 MCU4.24(PA14)
CH4_MCU_SWDIO: DA4.1 MCU4.23(PA13)
CH4_MOS_BU: C52.2 D14.1(C) MOSDRV4.20(VB1)
CH4_MOS_BV: C53.2 D15.1(C) MOSDRV4.17(VB2)
CH4_MOS_BW: C54.2 D16.1(C) MOSDRV4.14(VB3)
CH4_MOS_HU: MOSDRV4.19(HO1) RN9.4
CH4_MOS_HV: MOSDRV4.16(HO2) RN11.4
CH4_MOS_HW: MOSDRV4.13(HO3) RN13.4
CH4_MOS_LU: MOSDRV4.11(LO1) RN9.3
CH4_MOS_LV: MOSDRV4.10(LO2) RN11.3
CH4_MOS_LW: MOSDRV4.9(LO3) RN13.3
CH4_OUT_U: C52.1 MOSDRV4.18(VS1) PAD29.1 R34.2
CH4_OUT_V: C53.1 MOSDRV4.15(VS2) PAD35.1 R38.2
CH4_OUT_W: C54.1 MOSDRV4.12(VS3) PAD41.1 R42.2
CH4_SENS_U: MCU4.6(PA0) R33.2 R34.1 R48.2
CH4_SENS_V: MCU4.10(PA4) R37.2 R38.1 R47.2
CH4_SENS_W: MCU4.11(PA5) R41.2 R42.1 R46.2
CH4_SENS_ZERO: MCU4.7(PA1) R33.1 R37.1 R41.1
CUR_N: C2.2 CUR_N.1 U1.5(IN-)
CUR_P: C2.1 CUR_P.1 U1.4(IN+)
FB_LMR38025: R49.1 R50.2 U6.8(FB)
PWM_CH1_BOARD: MCU1.27(PB4) RN7.7
PWM_CH1_PORT: RN7.2 U4.4
PWM_CH2_BOARD: MCU2.27(PB4) RN7.8
PWM_CH2_PORT: RN7.1 U4.3
PWM_CH3_BOARD: MCU3.27(PB4) RN7.6
PWM_CH3_PORT: RN7.3 U4.2
PWM_CH4_BOARD: MCU4.27(PB4) RN7.5
PWM_CH4_PORT: RN7.4 U4.1
SENS_CUR: C25.2 R3.2 U4.6
SW_LMR38025: C18.2 L4.2 U6.11(SW) U6.12(SW)
TXS: MCU1.29(PB6) MCU2.29(PB6) MCU3.29(PB6) MCU4.29(PB6) U4.5
$1N3636: PAD6.1 RN1.2
$1N3640: PAD8.1 RN1.1
$1N3649: PAD12.1 RN3.2
$1N3653: PAD14.1 RN3.1
$1N3661: PAD18.1 RN5.2
$1N3665: PAD20.1 RN5.1
$1N8244: R3.1 U1.6(OUT)
$1N9187: PWR1.2(A) R20.2
$1N18898: MCU1.31(BOOT0) R1.1
$1N19006: C8.1 MCU1.4(NRST) R4.1
$1N21263: C9.1 MCU2.4(NRST) R5.1
$1N21267: PAD19.1 RN6.2
$1N21268: PAD21.1 RN6.1
$1N21269: PAD13.1 RN4.2
$1N21270: PAD15.1 RN4.1
$1N21289: PAD7.1 RN2.2
$1N21290: PAD9.1 RN2.1
$1N21353: MCU2.31(BOOT0) R2.1
$1N31702: PAD39.1 RN13.1
$1N31703: PAD37.1 RN13.2
$1N31731: MCU4.31(BOOT0) R28.1
$1N31743: C40.1 MCU4.4(NRST) R30.1
$1N31783: PAD24.1 RN8.2
$1N31784: PAD26.1 RN8.1
$1N31814: C39.1 MCU3.4(NRST) R29.1
$1N31889: PAD31.1 RN11.2
$1N31916: PAD36.1 RN12.2
$1N31917: PAD38.1 RN12.1
$1N31920: PAD30.1 RN10.2
$1N31921: PAD32.1 RN10.1
$1N31932: MCU3.31(BOOT0) R27.1
$1N35384: PAD33.1 RN11.1
$1N41788: PAD25.1 RN9.2
$1N41789: PAD27.1 RN9.1
$1N118124: R7.2 U2.4(RT/SYNC)
$1N118125: R55.2 R56.2 U2.2(EN)
$1N118134: C61.1 L2.1 U2.8(SW)
$1N118135: R58.2 U2.6(PG)
$1N118138: C61.2 U2.7(BOOT)
$1N118139: R6.1 R57.2 U2.5(FB)
Net-(C18-1): C18.1 U6.10(BOOT)
Net-(R51-1): R51.1 R52.1 U6.3(EN)
Net-(R53-2): R53.2 U6.9(PG)
Net-(R54-2): R54.2 U6.7(RT/SYNC)

Not connected (* = marked no-connect by the designer): MCU1 2(PF0/OSC_IN)* 3(PF1/OSC_OUT)* 8(PA2)* 9(PA3)* 12(PA6)* 16(PB2)* 21(PA11)* 22(PA12)* 25(PA15)* 26(PB3)* 28(PB5)* 30(PB7)* 32(PB8)*; MCU2 2(PF0/OSC_IN)* 3(PF1/OSC_OUT)* 8(PA2)* 9(PA3)* 12(PA6)* 16(PB2)* 21(PA11)* 22(PA12)* 25(PA15)* 26(PB3)* 28(PB5)* 30(PB7)* 32(PB8)*; MCU3 2(PF0/OSC_IN)* 3(PF1/OSC_OUT)* 8(PA2)* 9(PA3)* 12(PA6)* 16(PB2)* 21(PA11)* 22(PA12)* 25(PA15)* 26(PB3)* 28(PB5)* 30(PB7)* 32(PB8)*; MCU4 2(PF0/OSC_IN)* 3(PF1/OSC_OUT)* 8(PA2)* 9(PA3)* 12(PA6)* 16(PB2)* 21(PA11)* 22(PA12)* 25(PA15)* 26(PB3)* 28(PB5)* 30(PB7)* 32(PB8)*; MOSDRV1 5(NC)* 7(NC)* 8(NC)* 21(NC)*; MOSDRV2 5(NC)* 7(NC)* 8(NC)* 21(NC)*; MOSDRV3 5(NC)* 7(NC)* 8(NC)* 21(NC)*; MOSDRV4 5(NC)* 7(NC)* 8(NC)* 21(NC)*; U3 4(NC)*; U6 4(NC)*

## Notes on the sheet
- 高输入电压（>25V）时，INA199需要接在低侧
- 高输入电压（>50V）时，过零点检测电阻网络应该更换为更小的比例
- 运算放大器可以根据需选择INA199A1D/INA199A2D/INA199A3D
- BEC：主控供电3.3V
